# EAGLE schematic AX-03 (EAGLE 7.4.0)
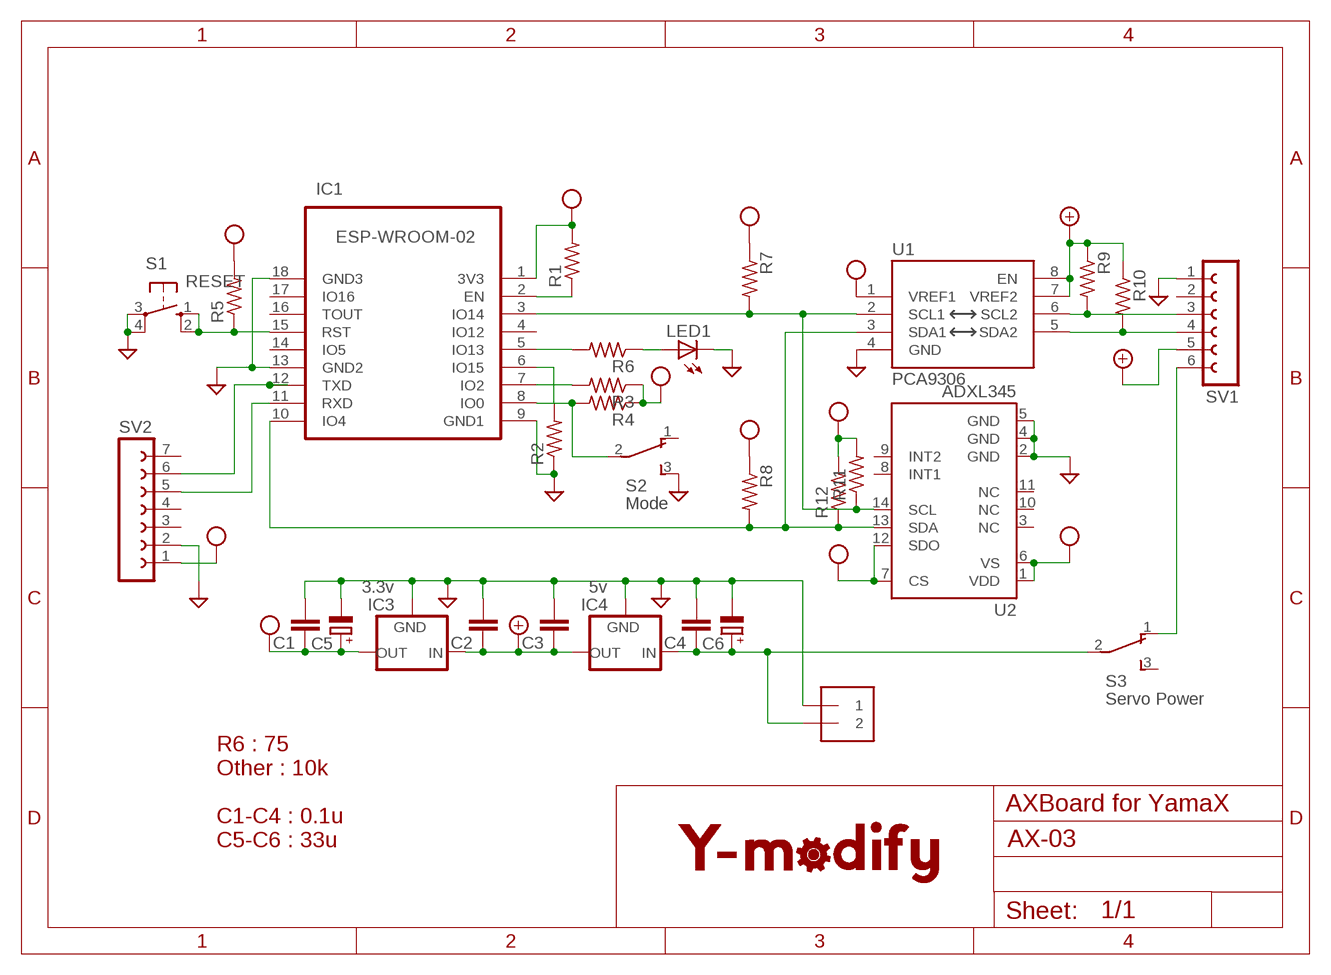
[diagram p0: schematic, sheet 1]

## Parts
C1  C-EU025-024X044  [C025-024X044]
C2  C-EU025-024X044  [C025-024X044]
C3  C-EU025-024X044  [C025-024X044]
C4  C-EU025-024X044  [C025-024X044]
C5  CPOL-EUE5-8.5  [E5-8,5]
C6  CPOL-EUE5-8.5  [E5-8,5]
IC1  ESP-WROOM-02  ESP-WROOM-02FRONT-FACE  [FRONT-FACE]
IC3  3.3v  78XXL  [78XXL]
IC4  5v  78XXL  [78XXL]
J1  1X2-3.5MM  [1X2-3.5MM]
LED1  LED3MM  [LED3MM]
R1  R-US_0204/7  [0204/7]
R2  R-US_0204/7  [0204/7]
R3  R-US_0204/7  [0204/7]
R4  R-US_0204/7  [0204/7]
R5  R-US_0204/7  [0204/7]
R6  R-US_0204/7  [0204/7]
R7  R-US_0204/7  [0204/7]
R8  R-US_0204/7  [0204/7]
R9  R-US_0204/7  [0204/7]
R10  R-US_0204/7  [0204/7]
R11  R-US_0204/7  [0204/7]
R12  R-US_0204/7  [0204/7]
S1  RESET  10-XX  [B3F-10XX]
S2  Mode  TL36YO  [TL3XYO]
S3  Servo Power  TL36YO  [TL3XYO]
SV1  FE06-1  [FE06]
SV2  FE07-1  [FE07]
U1  PCA9306  [PSOP-8]
U2  ADXL345  [LGA14]
U$1  Y-MODIFY  [Y-MODIFY]

## Nets
+5V: C2.1 C3.1 IC3.IN IC4.OUT R9.1 R10.1 SV1.5 U1.7(VREF2) U1.8(EN)
GND: C1.2 C2.2 C3.2 C4.2 C5.- C6.- IC1.9(GND1) IC1.13(GND2) IC1.18(GND3) IC3.GND IC4.GND J1.1 LED1.K(C) R2.1 S1.3(P) S1.4(P1) S2.3(S) SV1.1 SV2.2 U1.4(GND) U2.2(GND) U2.4(GND) U2.5(GND)
N$1: IC1.10(IO4) R8.2 R12.1 U1.3(SDA1) U2.13(SDA)
N$2: IC1.15(RST) R5.1 S1.1(S) S1.2(S1)
N$3: IC1.8(IO0) R4.2 S2.2(P)
N$4: IC1.7(IO2) R3.2
N$5: IC1.2(EN) R1.1
N$6: IC1.5(IO13) R6.2
N$7: IC1.6(IO15) R2.2
N$8: LED1.A R6.1
N$9: IC1.3(IO14) R7.2 R11.1 U1.2(SCL1) U2.14(SCL)
N$10: IC1.12(TXD) SV2.6
N$11: R9.2 SV1.3 U1.6(SCL2)
N$12: R10.2 SV1.4 U1.5(SDA2)
N$13: IC1.11(RXD) SV2.5
N$14: S3.1(O) SV1.6
N$15: C4.1 C6.+ IC4.IN J1.2 S3.2(P)
VCC: C1.1 C5.+ IC1.1(3V3) IC3.OUT R1.2 R3.1 R4.1 R5.2 R7.1 R8.1 R11.2 R12.2 SV2.1 U1.1(VREF1) U2.1(VDD) U2.6(VS) U2.7(CS) U2.12(SDO)
Unconnected: IC1.4(IO12) IC1.14(IO5) IC1.16(TOUT) IC1.17(IO16) S2.1(O) S3.3(S) SV1.2 SV2.3 SV2.4 SV2.7 U2.3(NC) U2.8(INT1) U2.9(INT2) U2.10(NC) U2.11(NC)

## Notes on the sheet
- AXBoard for YamaX
- R6 : 75
  Other : 10k
  
  C1-C4 : 0.1u
  C5-C6 : 33u

## Library data of the parts
C1-C4 = resistor:C-EU: CAPACITOR, European symbol
C5 C6 = resistor:CPOL-EU: POLARIZED CAPACITOR, European symbol
IC1 = esp-wroom-02:ESP-WROOM-02: WiFi module - ESP-WROOM-02
IC3 IC4 = v-reg:78XXL: VOLTAGE REGULATOR
J1 = adafruit:1X2: 3.5mm Terminal block http://www.ladyada.net/library/pcb/eaglelibrary.html
LED1 = led:LED: LED OSRAM: - CHIPLED LG R971, LG N971, LY N971, LG Q971, LY Q971, LO R971, LY R971 LH N974, LH R974 LS Q976, LO Q976, LY Q976 LO Q996 - Hyper CHIPLED LW Q18S LB Q993, LB Q99A, LB R99A - SideLED LS A670, LO A670, LY A670, LG A670, LP A670 LB A673, LV A673, LT A673, LW A673 LH A674 LY A675 LS A676, LA A676, LO A676, LY A676, LW A676 LS A679, LY A679, LG A679 - Hyper Micro SIDELED® LS Y876, LA Y876, LO Y876, LY Y876 LT Y87S - SmartLED LW L88C, LW L88S LB L89C, LB L89S, LG L890 LS L89K, LO L89K, LY L89K LS L896, LA L896, LO L896, LY L896 - TOPLED LS T670, LO T670, LY T670, LG T670, LP T670 LSG T670, LSP T670, LSY T670, LOP T670, LYG T670 LG T671, LOG T671, LSG T671 LB T673, LV T673, LT T673, LW T673 LH T674 LS T676, LA T676, LO T676, LY T676, LB T676, LH T676, LSB T676, LW T676 LB T67C, LV T67C, LT T67C, LS T67K, LO T67K, LY T67K, LW E67C LS E67B, LA E67B, LO E67B, LY E67B, LB E67C, LV E67C, LT E67C LW T67C LS T679, LY T679, LG T679 LS T770, LO T770, LY T770, LG T770, LP T770 LB T773, LV T773, LT T773, LW T773 LH T774 LS E675, LA E675, LY E675, LS T675 LS T776, LA T776, LO T776, LY T776, LB T776 LHGB T686 LT T68C, LB T68C - Hyper Mini TOPLED® LB M676 - Mini TOPLED Santana® LG M470 LS M47K, LO M47K, LY M47K Source: http://www.osram.convergy.de LUXEON: - LUMILED® LXK2-PW12-R00, LXK2-PW12-S00, LXK2-PW14-U00, LXK2-PW14-V00 LXK2-PM12-R00, LXK2-PM12-S00, LXK2-PM14-U00 LXK2-PE12-Q00, LXK2-PE12-R00, LXK2-PE12-S00, LXK2-PE14-T00, LXK2-PE14-U00 LXK2-PB12-K00, LXK2-PB12-L00, LXK2-PB12-M00, LXK2-PB14-N00, LXK2-PB14-P00, LXK2-PB14-Q00 LXK2-PR12-L00, LXK2-PR12-M00, LXK2-PR14-Q00, LXK2-PR14-R00 LXK2-PD12-Q00, LXK2-PD12-R00, LXK2-PD12-S00 LXK2-PH12-R00, LXK2-PH12-S00 LXK2-PL12-P00, LXK2-PL12-Q00, LXK2-PL12-R00 Source: www.luxeon.com KINGBRIGHT: KA-3528ASYC Source: www.kingbright.com
R1-R12 = resistor:R-US_: RESISTOR, American symbol
S1 = switch-omron:10-XX: OMRON SWITCH; MPN: B3F-1000; OC_FARNELL: 176432; OC_NEWARK: 36M3542
S2 S3 = switch:TL36YO: TINY SWITCH ON - ON Source: http://www2.produktinfo.conrad.com/datenblaetter/700000-724999/705152-da-01-de-Subminiaturschalter_TL_36YO.pdf
SV1 = con-lsta:FE06-1: FEMALE HEADER; OC_FARNELL: unknown; OC_NEWARK: unknown
SV2 = con-lsta:FE07-1: FEMALE HEADER; OC_FARNELL: unknown; OC_NEWARK: unknown
U1 = SparkFun-DigitalIC:PCA9306: Bidirectional I2C level shifter. NOT compatible with all available part number pinout schemes- DOUBLE CHECK!!!; PROD_ID: IC-10023
U2 = SparkFun-Sensors:ADXL345: 3-axis SPI/I2C 2/4/8/16g accelerometer
U$1 = y-modify:Y-MODIFY